# Altium project MotherBoard.PrjPcb
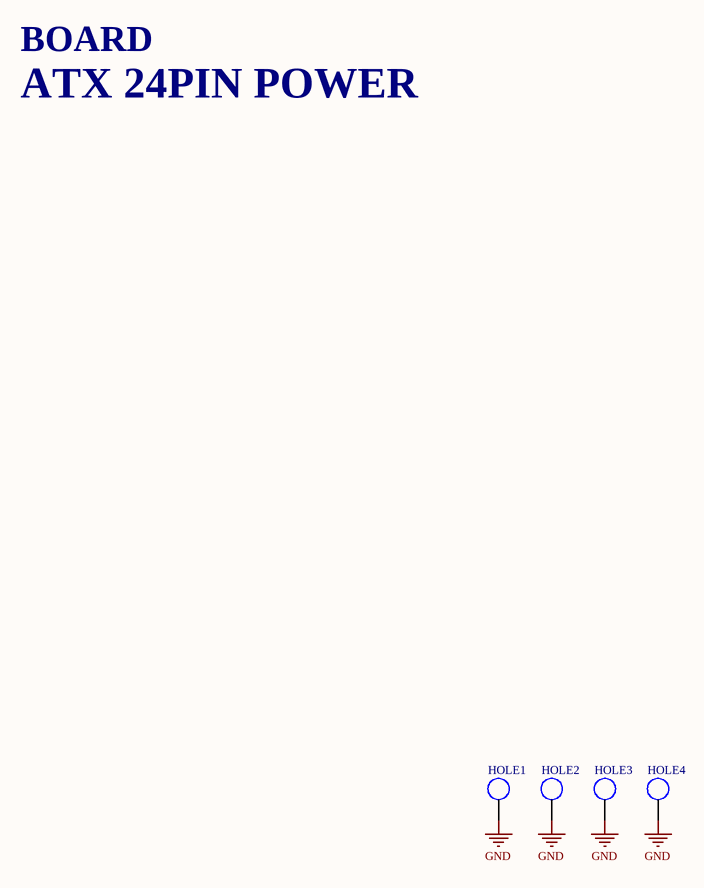
[diagram p0: 00_POWER.SchDoc]
5 sheets, 23 parts. Net scope: flat (ports and power ports of the same name join across sheets).
Board file: Board.PcbDoc
Sheets:
  00_POWER.SchDoc
  01_COREBOARD.SchDoc
  02_HDMI.SchDoc
  03_USB.SchDoc
  04_GBEPHY.SchDoc

## Sheet 00_POWER.SchDoc
size A; SheetNumber: 1; SheetTotal: 5

### Parts
HOLE1  LOADHOLE  [LOADHOLE]  (value not drawn)
HOLE2  LOADHOLE  [LOADHOLE]  (value not drawn)
HOLE3  LOADHOLE  [LOADHOLE]  (value not drawn)
HOLE4  LOADHOLE  [LOADHOLE]  (value not drawn)

### Nets
GND: HOLE1.1 HOLE2.1 HOLE3.1 HOLE4.1

### Notes on the sheet
- BOARD
- ATX 24PIN POWER

## Sheet 01_COREBOARD.SchDoc
size A0; SheetNumber: 2; SheetTotal: 5
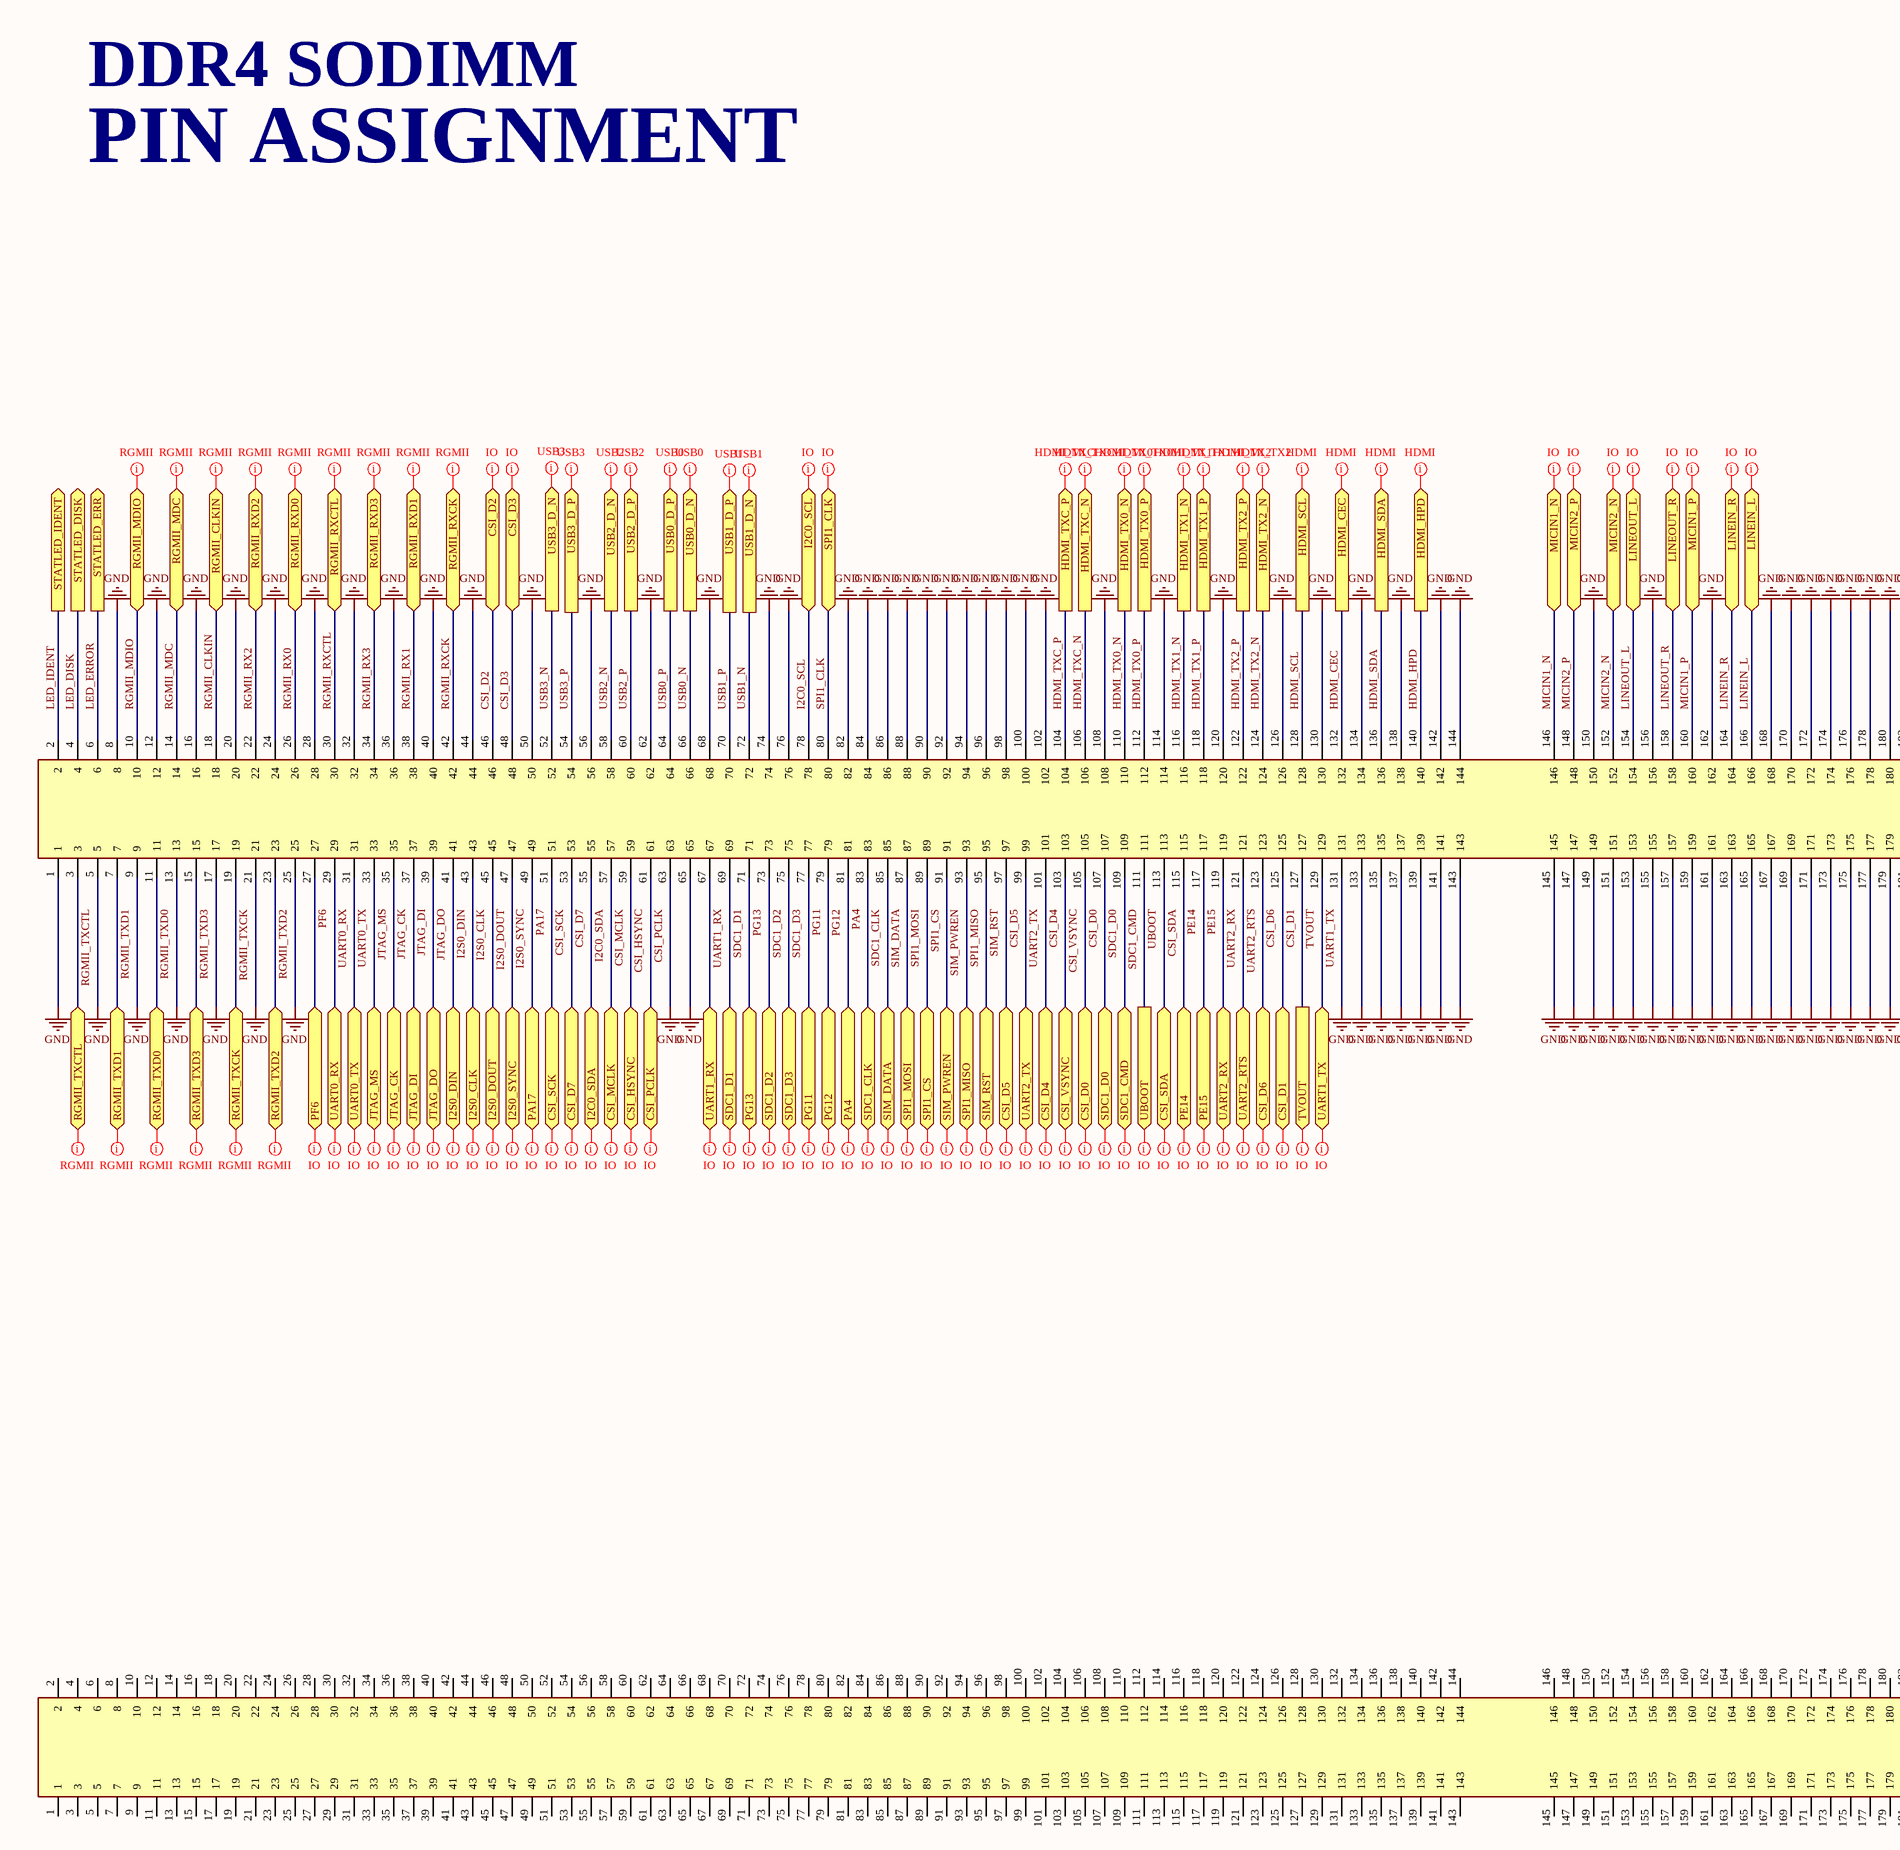
[diagram p1: 01_COREBOARD.SchDoc, left]
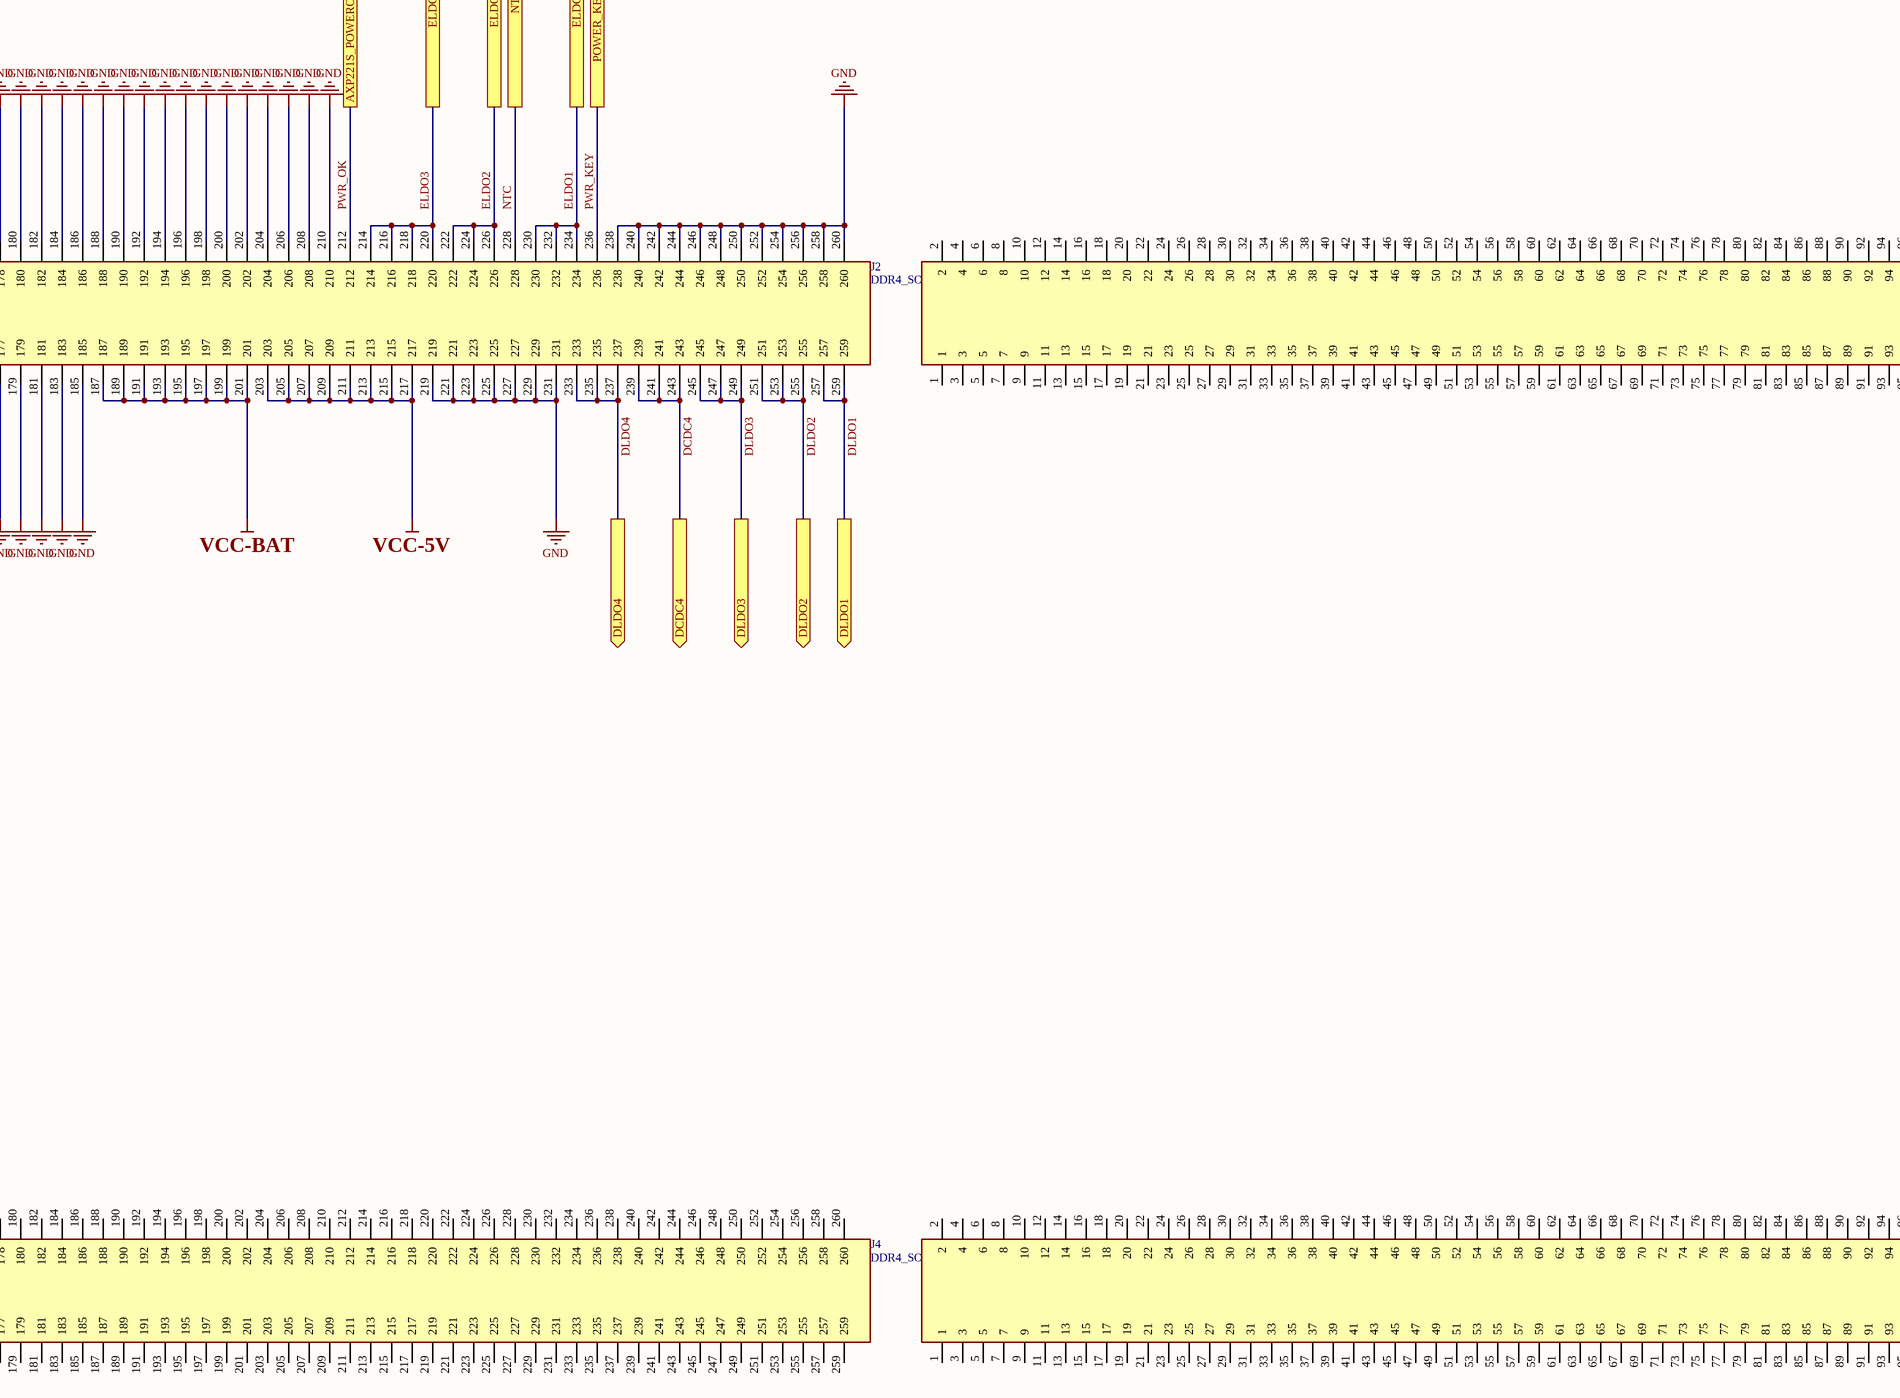
[diagram p2: 01_COREBOARD.SchDoc, middle]
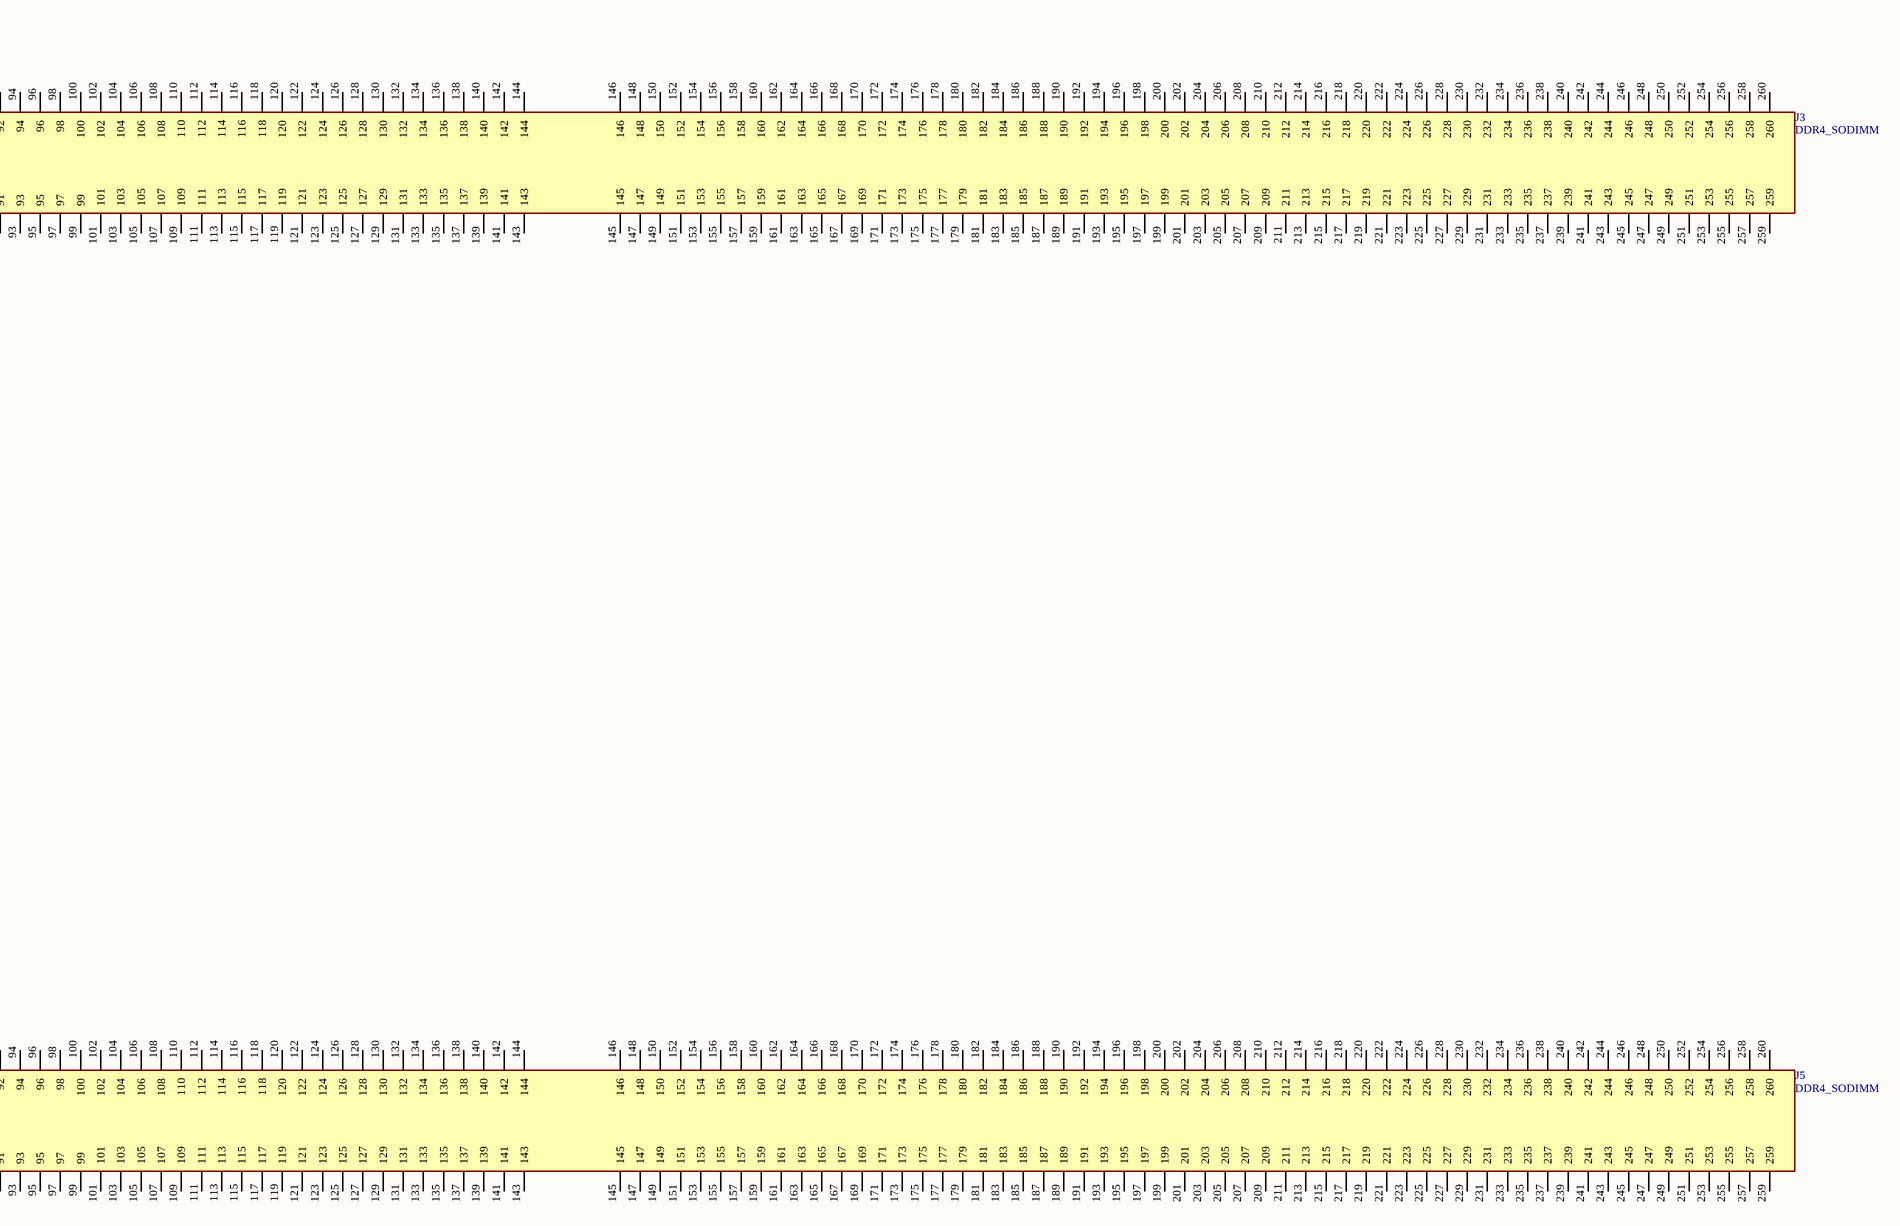
[diagram p3: 01_COREBOARD.SchDoc, right]

### Parts
J2  DDR4_SODIMM  [DDR4_SODIMM]
J3  DDR4_SODIMM  [DDR4_SODIMM]
J4  DDR4_SODIMM  [DDR4_SODIMM]
J5  DDR4_SODIMM  [DDR4_SODIMM]

### Ports
AXP221S_POWEROK (out), CSI_D0 (bidir), CSI_D1 (bidir), CSI_D2 (bidir), CSI_D3 (bidir), CSI_D4 (bidir), CSI_D5 (bidir), CSI_D6 (bidir), CSI_D7 (bidir), CSI_HSYNC (bidir), CSI_MCLK (bidir), CSI_PCLK (bidir), CSI_SCK (bidir), CSI_SDA (bidir), CSI_VSYNC (bidir), DCDC4 (out), DLDO1 (out), DLDO2 (out), DLDO3 (out), DLDO4 (out), ELDO1 (out), ELDO2 (out), ELDO3 (out), HDMI_CEC (out), HDMI_HPD (out), HDMI_SCL (out), HDMI_SDA (out), HDMI_TX0_N (out), HDMI_TX0_P (out), HDMI_TX1_N (out), HDMI_TX1_P (out), HDMI_TX2_N (out), HDMI_TX2_P (out), HDMI_TXC_N (out), HDMI_TXC_P (out), I2C0_SCL (bidir), I2C0_SDA (bidir), I2S0_CLK (bidir), I2S0_DIN (bidir), I2S0_DOUT (bidir), I2S0_SYNC (bidir), JTAG_CK (bidir), JTAG_DI (bidir), JTAG_DO (bidir), JTAG_MS (bidir), LINEIN_L (bidir), LINEIN_R (bidir), LINEOUT_L (bidir), LINEOUT_R (bidir), MICIN1_N (bidir), MICIN1_P (bidir), MICIN2_N (bidir), MICIN2_P (bidir), NTC (out), PA4 (bidir), PA17 (bidir), PE14 (bidir), PE15 (bidir), PF6 (bidir), PG11 (bidir), PG12 (bidir), PG13 (bidir), POWER_KEY (out), RGMII_CLKIN (bidir), RGMII_MDC (bidir), RGMII_MDIO (bidir), RGMII_RXCK (bidir), RGMII_RXCTL (bidir), RGMII_RXD0 (bidir), RGMII_RXD1 (bidir), RGMII_RXD2 (bidir), RGMII_RXD3 (bidir), RGMII_TXCK (bidir), RGMII_TXCTL (bidir), RGMII_TXD0 (bidir), RGMII_TXD1 (bidir), RGMII_TXD2 (bidir), RGMII_TXD3 (bidir), SDC1_CLK (bidir), SDC1_CMD (bidir), SDC1_D0 (bidir), SDC1_D1 (bidir), SDC1_D2 (bidir), SDC1_D3 (bidir), SIM_DATA (bidir), SIM_PWREN (bidir), SIM_RST (bidir), SPI1_CLK (bidir), SPI1_CS (bidir), SPI1_MISO (bidir), SPI1_MOSI (bidir), STATLED_DISK (out), STATLED_ERR (out), STATLED_IDENT (out), TVOUT (out), UART0_RX (bidir), UART0_TX (bidir), UART1_RX (bidir), UART1_TX (bidir), UART2_RTS (bidir), UART2_RX (bidir), UART2_TX (bidir), UBOOT (out), USB0_D_N (out), USB0_D_P (out), USB1_D_N (out), USB1_D_P (out), USB2_D_N (out), USB2_D_P (out), USB3_D_N (out), USB3_D_P (out)

### Nets
GND: J2.1 J2.5 J2.8 J2.9 J2.12 J2.13 J2.16 J2.17 J2.20 J2.21 J2.24 J2.25 J2.28 J2.32 J2.36 J2.40 J2.44 J2.50 J2.56 J2.62 J2.63 J2.65 J2.68 J2.74 J2.76 J2.82 J2.84 J2.86 J2.88 J2.90 J2.92 J2.94 J2.96 J2.98 J2.100 J2.102 J2.108 J2.114 J2.120 J2.126 J2.130 J2.131 J2.133 J2.134 J2.135 J2.137 J2.138 J2.139 J2.141 J2.142 J2.143 J2.144 J2.145 J2.147 J2.149 J2.150 J2.151 J2.153 J2.155 J2.156 J2.157 J2.159 J2.161 J2.162 J2.163 J2.165 J2.167 J2.168 J2.169 J2.170 J2.171 J2.172 J2.173 J2.174 J2.175 J2.176 J2.177 J2.178 J2.179 J2.180 J2.181 J2.182 J2.183 J2.184 J2.185 J2.186 J2.188 J2.190 J2.192 J2.194 J2.196 J2.198 J2.200 J2.202 J2.204 J2.206 J2.208 J2.210 J2.219 J2.221 J2.223 J2.225 J2.227 J2.229 J2.231 J2.238 J2.240 J2.242 J2.244 J2.246 J2.248 J2.250 J2.252 J2.254 J2.256 J2.258 J2.260
VCC-5V: J2.203 J2.205 J2.207 J2.209 J2.211 J2.213 J2.215 J2.217
VCC-BAT: J2.187 J2.189 J2.191 J2.193 J2.195 J2.197 J2.199 J2.201
CSI_D0: J2.105 ; port CSI_D0
CSI_D1: J2.125 ; port CSI_D1
CSI_D2: J2.46 ; port CSI_D2
CSI_D3: J2.48 ; port CSI_D3
CSI_D4: J2.101 ; port CSI_D4
CSI_D5: J2.97 ; port CSI_D5
CSI_D6: J2.123 ; port CSI_D6
CSI_D7: J2.53 ; port CSI_D7
CSI_HSYNC: J2.59 ; port CSI_HSYNC
CSI_MCLK: J2.57 ; port CSI_MCLK
CSI_PCLK: J2.61 ; port CSI_PCLK
CSI_SCK: J2.51 ; port CSI_SCK
CSI_SDA: J2.113 ; port CSI_SDA
CSI_VSYNC: J2.103 ; port CSI_VSYNC
DCDC4: J2.239 J2.241 J2.243 ; port DCDC4
DLDO1: J2.257 J2.259 ; port DLDO1
DLDO2: J2.251 J2.253 J2.255 ; port DLDO2
DLDO3: J2.245 J2.247 J2.249 ; port DLDO3
DLDO4: J2.233 J2.235 J2.237 ; port DLDO4
ELDO1: J2.230 J2.232 J2.234 ; port ELDO1
ELDO2: J2.222 J2.224 J2.226 ; port ELDO2
ELDO3: J2.214 J2.216 J2.218 J2.220 ; port ELDO3
HDMI_CEC: J2.132 ; port HDMI_CEC
HDMI_HPD: J2.140 ; port HDMI_HPD
HDMI_SCL: J2.128 ; port HDMI_SCL
HDMI_SDA: J2.136 ; port HDMI_SDA
HDMI_TX0_N: J2.110 ; port HDMI_TX0_N
HDMI_TX0_P: J2.112 ; port HDMI_TX0_P
HDMI_TX1_N: J2.116 ; port HDMI_TX1_N
HDMI_TX1_P: J2.118 ; port HDMI_TX1_P
HDMI_TX2_N: J2.124 ; port HDMI_TX2_N
HDMI_TX2_P: J2.122 ; port HDMI_TX2_P
HDMI_TXC_N: J2.106 ; port HDMI_TXC_N
HDMI_TXC_P: J2.104 ; port HDMI_TXC_P
I2C0_SCL: J2.78 ; port I2C0_SCL
I2C0_SDA: J2.55 ; port I2C0_SDA
I2S0_CLK: J2.43 ; port I2S0_CLK
I2S0_DIN: J2.41 ; port I2S0_DIN
I2S0_DOUT: J2.45 ; port I2S0_DOUT
I2S0_SYNC: J2.47 ; port I2S0_SYNC
JTAG_CK: J2.35 ; port JTAG_CK
JTAG_DI: J2.37 ; port JTAG_DI
JTAG_DO: J2.39 ; port JTAG_DO
JTAG_MS: J2.33 ; port JTAG_MS
LED_DISK: J2.4 ; port STATLED_DISK
LED_ERROR: J2.6 ; port STATLED_ERR
LED_IDENT: J2.2 ; port STATLED_IDENT
LINEIN_L: J2.166 ; port LINEIN_L
LINEIN_R: J2.164 ; port LINEIN_R
LINEOUT_L: J2.154 ; port LINEOUT_L
LINEOUT_R: J2.158 ; port LINEOUT_R
MICIN1_N: J2.146 ; port MICIN1_N
MICIN1_P: J2.160 ; port MICIN1_P
MICIN2_N: J2.152 ; port MICIN2_N
MICIN2_P: J2.148 ; port MICIN2_P
NTC: J2.228 ; port NTC
PA4: J2.81 ; port PA4
PA17: J2.49 ; port PA17
PE14: J2.115 ; port PE14
PE15: J2.117 ; port PE15
PF6: J2.27 ; port PF6
PG11: J2.77 ; port PG11
PG12: J2.79 ; port PG12
PG13: J2.71 ; port PG13
PWR_KEY: J2.236 ; port POWER_KEY
PWR_OK: J2.212 ; port AXP221S_POWEROK
RGMII_CLKIN: J2.18 ; port RGMII_CLKIN
RGMII_MDC: J2.14 ; port RGMII_MDC
RGMII_MDIO: J2.10 ; port RGMII_MDIO
RGMII_RX0: J2.26 ; port RGMII_RXD0
RGMII_RX1: J2.38 ; port RGMII_RXD1
RGMII_RX2: J2.22 ; port RGMII_RXD2
RGMII_RX3: J2.34 ; port RGMII_RXD3
RGMII_RXCK: J2.42 ; port RGMII_RXCK
RGMII_RXCTL: J2.30 ; port RGMII_RXCTL
RGMII_TXCK: J2.19 ; port RGMII_TXCK
RGMII_TXCTL: J2.3 ; port RGMII_TXCTL
RGMII_TXD0: J2.11 ; port RGMII_TXD0
RGMII_TXD1: J2.7 ; port RGMII_TXD1
RGMII_TXD2: J2.23 ; port RGMII_TXD2
RGMII_TXD3: J2.15 ; port RGMII_TXD3
SDC1_CLK: J2.83 ; port SDC1_CLK
SDC1_CMD: J2.109 ; port SDC1_CMD
SDC1_D0: J2.107 ; port SDC1_D0
SDC1_D1: J2.69 ; port SDC1_D1
SDC1_D2: J2.73 ; port SDC1_D2
SDC1_D3: J2.75 ; port SDC1_D3
SIM_DATA: J2.85 ; port SIM_DATA
SIM_PWREN: J2.91 ; port SIM_PWREN
SIM_RST: J2.95 ; port SIM_RST
SPI1_CLK: J2.80 ; port SPI1_CLK
SPI1_CS: J2.89 ; port SPI1_CS
SPI1_MISO: J2.93 ; port SPI1_MISO
SPI1_MOSI: J2.87 ; port SPI1_MOSI
TVOUT: J2.127 ; port TVOUT
UART0_RX: J2.29 ; port UART0_RX
UART0_TX: J2.31 ; port UART0_TX
UART1_RX: J2.67 ; port UART1_RX
UART1_TX: J2.129 ; port UART1_TX
UART2_RTS: J2.121 ; port UART2_RTS
UART2_RX: J2.119 ; port UART2_RX
UART2_TX: J2.99 ; port UART2_TX
UBOOT: J2.111 ; port UBOOT
USB0_N: J2.66 ; port USB0_D_N
USB0_P: J2.64 ; port USB0_D_P
USB1_N: J2.72 ; port USB1_D_N
USB1_P: J2.70 ; port USB1_D_P
USB2_N: J2.58 ; port USB2_D_N
USB2_P: J2.60 ; port USB2_D_P
USB3_N: J2.52 ; port USB3_D_N
USB3_P: J2.54 ; port USB3_D_P

Not connected (* = marked no-connect by the designer): J3 1 2 3 4 5 6 7 8 9 10 11 12 13 14 15 16 17 18 19 20 21 22 23 24 25 26 27 28 29 30 31 32 33 34 35 36 37 38 39 40 41 42 43 44 45 46 47 48 49 50 51 52 53 54 55 56 57 58 59 60 61 62 63 64 65 66 67 68 69 70 71 72 73 74 75 76 77 78 79 80 81 82 83 84 85 86 87 88 89 90 91 92 93 94 95 96 97 98 99 100 101 102 103 104 105 106 107 108 109 110 111 112 113 114 115 116 117 118 119 120 121 122 123 124 125 126 127 128 129 130 131 132 133 134 135 136 137 138 139 140 141 142 143 144 145 146 147 148 149 150 151 152 153 154 155 156 157 158 159 160 161 162 163 164 165 166 167 168 169 170 171 172 173 174 175 176 177 178 179 180 181 182 183 184 185 186 187 188 189 190 191 192 193 194 195 196 197 198 199 200 201 202 203 204 205 206 207 208 209 210 211 212 213 214 215 216 217 218 219 220 221 222 223 224 225 226 227 228 229 230 231 232 233 234 235 236 237 238 239 240 241 242 243 244 245 246 247 248 249 250 251 252 253 254 255 256 257 258 259 260; J4 1 2 3 4 5 6 7 8 9 10 11 12 13 14 15 16 17 18 19 20 21 22 23 24 25 26 27 28 29 30 31 32 33 34 35 36 37 38 39 40 41 42 43 44 45 46 47 48 49 50 51 52 53 54 55 56 57 58 59 60 61 62 63 64 65 66 67 68 69 70 71 72 73 74 75 76 77 78 79 80 81 82 83 84 85 86 87 88 89 90 91 92 93 94 95 96 97 98 99 100 101 102 103 104 105 106 107 108 109 110 111 112 113 114 115 116 117 118 119 120 121 122 123 124 125 126 127 128 129 130 131 132 133 134 135 136 137 138 139 140 141 142 143 144 145 146 147 148 149 150 151 152 153 154 155 156 157 158 159 160 161 162 163 164 165 166 167 168 169 170 171 172 173 174 175 176 177 178 179 180 181 182 183 184 185 186 187 188 189 190 191 192 193 194 195 196 197 198 199 200 201 202 203 204 205 206 207 208 209 210 211 212 213 214 215 216 217 218 219 220 221 222 223 224 225 226 227 228 229 230 231 232 233 234 235 236 237 238 239 240 241 242 243 244 245 246 247 248 249 250 251 252 253 254 255 256 257 258 259 260; J5 1 2 3 4 5 6 7 8 9 10 11 12 13 14 15 16 17 18 19 20 21 22 23 24 25 26 27 28 29 30 31 32 33 34 35 36 37 38 39 40 41 42 43 44 45 46 47 48 49 50 51 52 53 54 55 56 57 58 59 60 61 62 63 64 65 66 67 68 69 70 71 72 73 74 75 76 77 78 79 80 81 82 83 84 85 86 87 88 89 90 91 92 93 94 95 96 97 98 99 100 101 102 103 104 105 106 107 108 109 110 111 112 113 114 115 116 117 118 119 120 121 122 123 124 125 126 127 128 129 130 131 132 133 134 135 136 137 138 139 140 141 142 143 144 145 146 147 148 149 150 151 152 153 154 155 156 157 158 159 160 161 162 163 164 165 166 167 168 169 170 171 172 173 174 175 176 177 178 179 180 181 182 183 184 185 186 187 188 189 190 191 192 193 194 195 196 197 198 199 200 201 202 203 204 205 206 207 208 209 210 211 212 213 214 215 216 217 218 219 220 221 222 223 224 225 226 227 228 229 230 231 232 233 234 235 236 237 238 239 240 241 242 243 244 245 246 247 248 249 250 251 252 253 254 255 256 257 258 259 260

### Layout directives
differential pair; differential pair class USB0; rule Differential Pairs Routing [Pref Gap = 6mil    Min Gap  = 6mil    Max Gap  = 6milPref Width = 4.29mil    Min Width  = 4.29mil    Max Width  = 4.29mil]; net class USB: USB0_N, USB0_P
differential pair; differential pair class USB2; rule Differential Pairs Routing [Pref Gap = 6mil    Min Gap  = 6mil    Max Gap  = 6milPref Width = 4.29mil    Min Width  = 4.29mil    Max Width  = 4.29mil]; net class USB: USB2_N, USB2_P
differential pair; differential pair class USB3; rule Differential Pairs Routing [Pref Gap = 6mil    Min Gap  = 6mil    Max Gap  = 6milPref Width = 4.29mil    Min Width  = 4.29mil    Max Width  = 4.29mil]; net class USB: USB3_N, USB3_P
differential pair; differential pair class USB1; rule Differential Pairs Routing [Pref Gap = 6mil    Min Gap  = 6mil    Max Gap  = 6milPref Width = 4.29mil    Min Width  = 4.29mil    Max Width  = 4.29mil]; net class USB: USB1_N, USB1_P
net class RGMII; rule Width Constraint [Pref Width = 4.99mil    Min Width = 4.99mil    Max Width = 4.99mil]: RGMII_CLKIN, RGMII_MDC, RGMII_MDIO, RGMII_RX0, RGMII_RX1, RGMII_RX2, RGMII_RX3, RGMII_RXCK, RGMII_RXCTL, RGMII_TXCK, RGMII_TXCTL, RGMII_TXD0, RGMII_TXD1, RGMII_TXD2, RGMII_TXD3
net class GPIO: I2C0_SCL, I2C0_SDA, I2S0_CLK, I2S0_DIN, I2S0_DOUT, I2S0_SYNC, JTAG_CK, JTAG_DI, JTAG_DO, JTAG_MS, LINEIN_L, LINEIN_R, LINEOUT_L, LINEOUT_R, MICIN1_N, MICIN1_P, MICIN2_N, MICIN2_P, PA4, PA17, PE14, PE15, PF6, PG11, PG12, PG13, SDC1_CLK, SDC1_CMD, SDC1_D0, SDC1_D1, SDC1_D2, SDC1_D3, SIM_DATA, SIM_PWREN, SIM_RST, SPI1_CLK, SPI1_CS, SPI1_MISO, SPI1_MOSI, TVOUT, UART0_RX, UART0_TX, UART1_RX, UART1_TX, UART2_RTS, UART2_RX, UART2_TX, UBOOT
differential pair; differential pair class HDMI_TX0; rule Differential Pairs Routing [Pref Gap = 6mil    Min Gap  = 6mil    Max Gap  = 6milPref Width = 4.29mil    Min Width  = 4.29mil    Max Width  = 4.29mil]; net class HDMI: HDMI_TX0_N, HDMI_TX0_P
differential pair; differential pair class HDMI_TX1; rule Differential Pairs Routing [Pref Gap = 6mil    Min Gap  = 6mil    Max Gap  = 6milPref Width = 4.29mil    Min Width  = 4.29mil    Max Width  = 4.29mil]; net class HDMI: HDMI_TX1_N, HDMI_TX1_P
differential pair; differential pair class HDMI_TX2; rule Differential Pairs Routing [Pref Gap = 6mil    Min Gap  = 6mil    Max Gap  = 6milPref Width = 4.29mil    Min Width  = 4.29mil    Max Width  = 4.29mil]; net class HDMI: HDMI_TX2_N, HDMI_TX2_P
differential pair; differential pair class HDMI_TXC; rule Differential Pairs Routing [Pref Gap = 6mil    Min Gap  = 6mil    Max Gap  = 6milPref Width = 4.29mil    Min Width  = 4.29mil    Max Width  = 4.29mil]; net class HDMI: HDMI_TXC_N, HDMI_TXC_P
net class GPIO; net class CSI: CSI_D0, CSI_D1, CSI_D2, CSI_D3, CSI_D4, CSI_D5, CSI_D6, CSI_D7, CSI_HSYNC, CSI_MCLK, CSI_PCLK, CSI_SCK, CSI_SDA, CSI_VSYNC
net class HDMI; rule Width Constraint [Pref Width = 4.99mil    Min Width = 4.99mil    Max Width = 4.99mil]: HDMI_CEC, HDMI_HPD, HDMI_SCL, HDMI_SDA

### Notes on the sheet
- DDR4 SODIMM
- PIN ASSIGNMENT

## Sheet 02_HDMI.SchDoc
size A; SheetNumber: 3; SheetTotal: 5
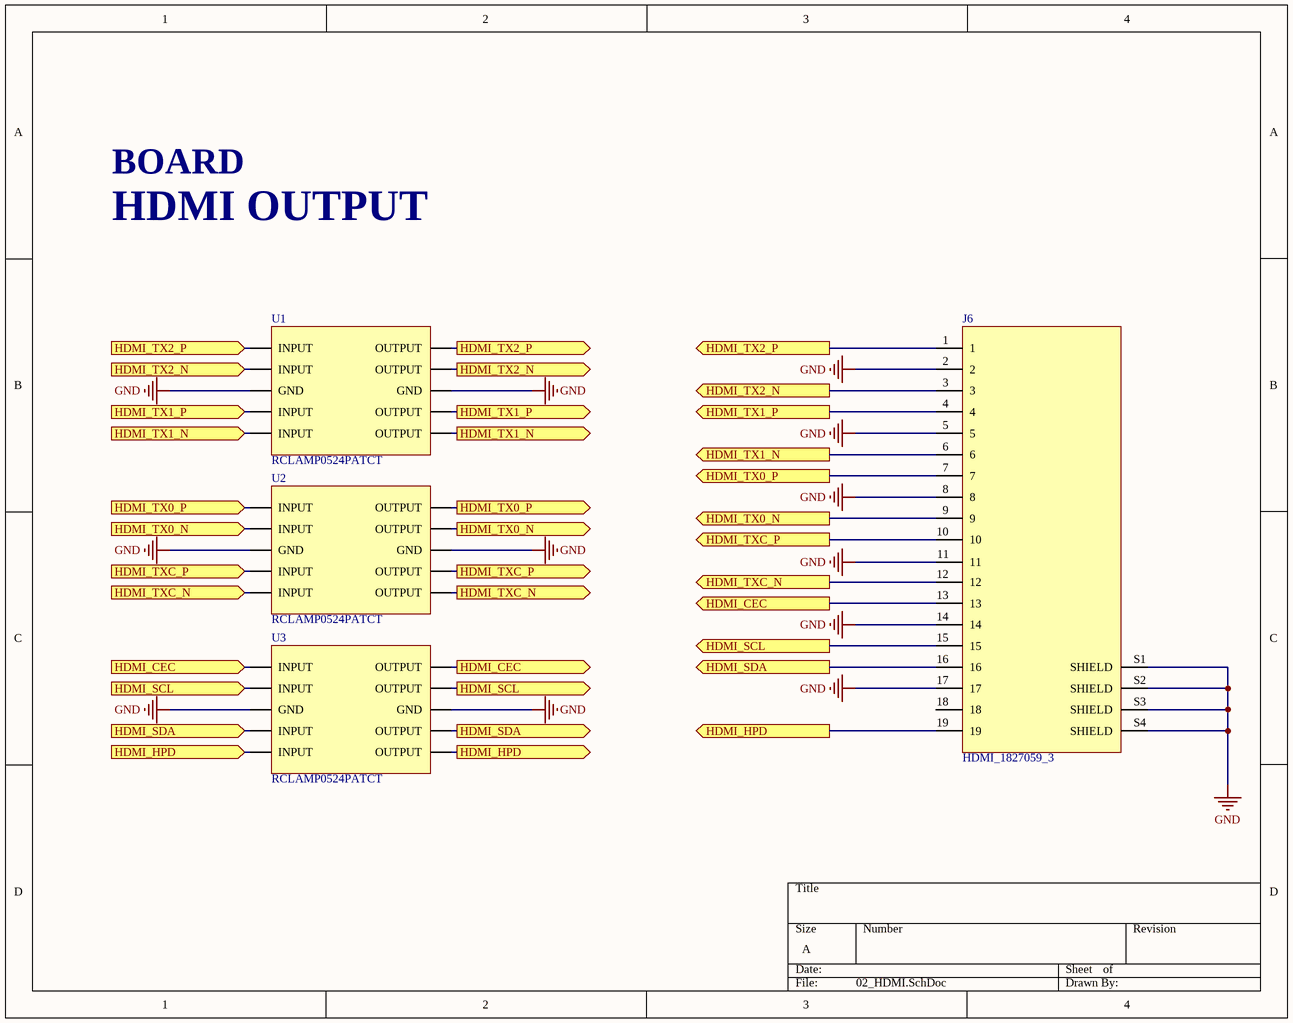
[diagram p4: 02_HDMI.SchDoc]

### Parts
J6  HDMI_1827059_3  [HDMI_1827059_3]
U1  RCLAMP0524PATCT  [RCLAMP0524PATCT]
U2  RCLAMP0524PATCT  [RCLAMP0524PATCT]
U3  RCLAMP0524PATCT  [RCLAMP0524PATCT]

### Ports
HDMI_CEC (in), HDMI_CEC (out), HDMI_HPD (in), HDMI_HPD (out), HDMI_SCL (in), HDMI_SCL (out), HDMI_SDA (in), HDMI_SDA (out), HDMI_TX0_N (in), HDMI_TX0_N (out), HDMI_TX0_P (in), HDMI_TX0_P (out), HDMI_TX1_N (in), HDMI_TX1_N (out), HDMI_TX1_P (in), HDMI_TX1_P (out), HDMI_TX2_N (in), HDMI_TX2_N (out), HDMI_TX2_P (in), HDMI_TX2_P (out), HDMI_TXC_N (in), HDMI_TXC_N (out), HDMI_TXC_P (in), HDMI_TXC_P (out)

### Nets
GND: J6.2 J6.5 J6.8 J6.11 J6.14 J6.17 J6.S1(SHIELD) J6.S2(SHIELD) J6.S3(SHIELD) J6.S4(SHIELD) U1.3(GND) U1.8(GND) U2.3(GND) U2.8(GND) U3.3(GND) U3.8(GND)
HDMI_CEC: J6.13 U3.1(INPUT) U3.10(OUTPUT) ; port HDMI_CEC
HDMI_HPD: J6.19 U3.5(INPUT) U3.6(OUTPUT) ; port HDMI_HPD
HDMI_SCL: J6.15 U3.2(INPUT) U3.9(OUTPUT) ; port HDMI_SCL
HDMI_SDA: J6.16 U3.4(INPUT) U3.7(OUTPUT) ; port HDMI_SDA
HDMI_TX0_N: J6.9 U2.2(INPUT) U2.9(OUTPUT) ; port HDMI_TX0_N
HDMI_TX0_P: J6.7 U2.1(INPUT) U2.10(OUTPUT) ; port HDMI_TX0_P
HDMI_TX1_N: J6.6 U1.5(INPUT) U1.6(OUTPUT) ; port HDMI_TX1_N
HDMI_TX1_P: J6.4 U1.4(INPUT) U1.7(OUTPUT) ; port HDMI_TX1_P
HDMI_TX2_N: J6.3 U1.2(INPUT) U1.9(OUTPUT) ; port HDMI_TX2_N
HDMI_TX2_P: J6.1 U1.1(INPUT) U1.10(OUTPUT) ; port HDMI_TX2_P
HDMI_TXC_N: J6.12 U2.5(INPUT) U2.6(OUTPUT) ; port HDMI_TXC_N
HDMI_TXC_P: J6.10 U2.4(INPUT) U2.7(OUTPUT) ; port HDMI_TXC_P

Not connected (* = marked no-connect by the designer): J6 18

### Notes on the sheet
- BOARD
- HDMI OUTPUT

## Sheet 03_USB.SchDoc
size A3; SheetNumber: 4; SheetTotal: 5
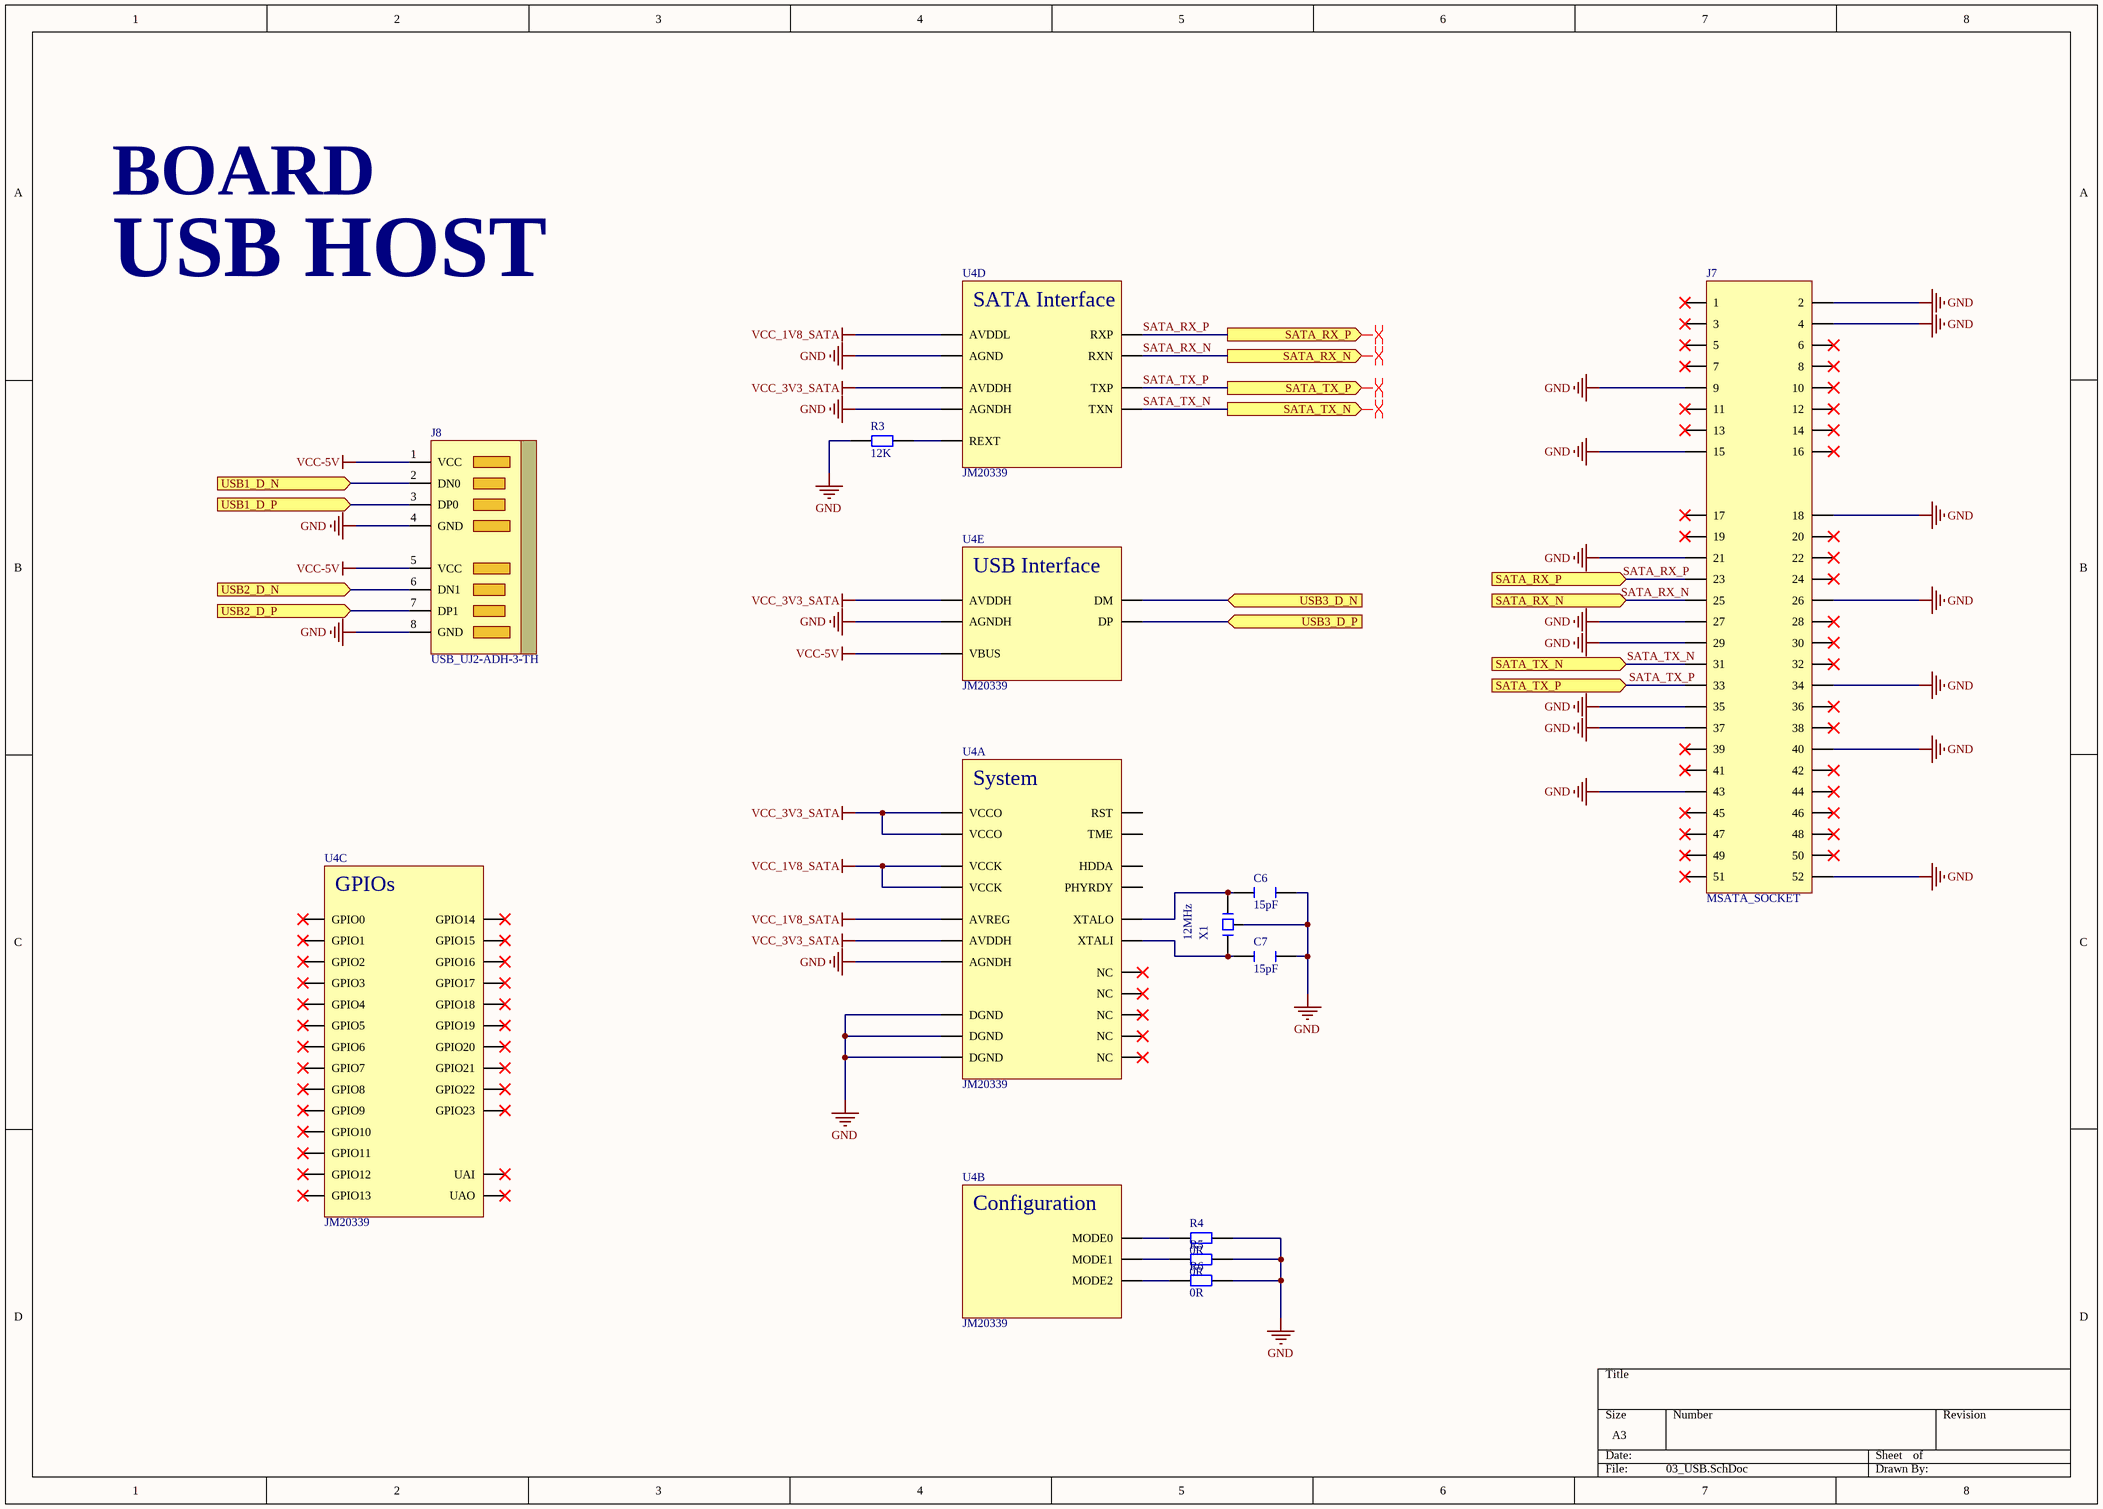
[diagram p5: 03_USB.SchDoc]

### Parts
C6  15pF  [C0402]
C7  15pF  [C0402]
J7  MSATA_SOCKET  [MSATA_SOCKET]
J8  USB_UJ2-ADH-3-TH  [UJ2-ADH-3-TH]
R3  12K  [R0603]
R4  0R  [R0603]
R5  0R  [R0603]
R6  0R  [R0603]
U4  JM20339  [JM20339]  (parts A,B,C,D,E of 5)
X1  12MHz  [SMD3225]

### Ports
SATA_RX_N (in), SATA_RX_N (out), SATA_RX_P (in), SATA_RX_P (out), SATA_TX_N (in), SATA_TX_N (out), SATA_TX_P (in), SATA_TX_P (out), USB1_D_N (in), USB1_D_P (in), USB2_D_N (in), USB2_D_P (in), USB3_D_N (in), USB3_D_P (in)

### Nets
GND: C6.2 C7.2 J7.2 J7.4 J7.9 J7.15 J7.18 J7.21 J7.26 J7.27 J7.29 J7.34 J7.35 J7.37 J7.40 J7.43 J7.52 J8.4(GND) J8.8(GND) R3.1 R4.2 R5.2 R6.2 U4.7(DGND) U4.16(AGNDH) U4.22(AGNDH) U4.25(AGNDH) U4.30(AGND) U4.41(DGND) U4.57(DGND) X1.3(G)
VCC-5V: J8.1(VCC) J8.5(VCC) U4.13(VBUS)
VCC_1V8_SATA: U4.14(AVREG) U4.29(AVDDL) U4.42(VCCK) U4.58(VCCK)
VCC_3V3_SATA: U4.8(VCCO) U4.15(AVDDH) U4.21(AVDDH) U4.24(AVDDH) U4.56(VCCO)
SATA_RX_N: J7.25 U4.28(RXN) ; port SATA_RX_N
SATA_RX_P: J7.23 U4.27(RXP) ; port SATA_RX_P
SATA_TX_N: J7.31 U4.31(TXN) ; port SATA_TX_N
SATA_TX_P: J7.33 U4.32(TXP) ; port SATA_TX_P
USB1_N: J8.2(DN0) ; port USB1_D_N
USB1_P: J8.3(DP0) ; port USB1_D_P
USB2_N: J8.6(DN1) ; port USB2_D_N
USB2_P: J8.7(DP1) ; port USB2_D_P
USB3_N: U4.19(DM) ; port USB3_D_N
USB3_P: U4.20(DP) ; port USB3_D_P
NetC6_1: C6.1 U4.18(XTALO) X1.2(OUT)
NetC7_1: C7.1 U4.17(XTALI) X1.1(IN)
NetR3_2: R3.2 U4.26(REXT)
NetR4_1: R4.1 U4.59(MODE0)
NetR5_1: R5.1 U4.55(MODE1)
NetR6_1: R6.1 U4.4(MODE2)

Not connected (* = marked no-connect by the designer): J7 1* 3* 5* 6* 7* 8* 10* 11* 12* 13* 14* 16* 17* 19* 20* 22* 24* 28* 30* 32* 36* 38* 39* 41* 42* 44* 45* 46* 47* 48* 49* 50* 51*; U4 1(GPIO21)* 2(GPIO22)* 3(GPIO23)* 5(NC)* 6(NC)* 9(NC)* 10(NC)* 11(GPIO7)* 12(RST) 23(NC)* 33(GPIO3)* 34(GPIO2)* 35(GPIO1)* 36(GPIO0)* 37(TME) 38(PHYRDY) 39(HDDA) 40(GPIO4)* 43(GPIO5)* 44(GPIO6)* 45(GPIO9)* 46(GPIO10)* 47(GPIO11)* 48(GPIO12)* 49(GPIO13)* 50(GPIO14)* 51(GPIO15)* 52(GPIO8)* 53(UAI)* 54(UAO)* 60(GPIO16)* 61(GPIO17)* 62(GPIO18)* 63(GPIO19)* 64(GPIO20)*

### Layout directives
differential pair; net class SATA; differential pair class SATA_TXRX; differential pair class SATA_RX: SATA_RX_N, SATA_RX_P
differential pair; net class SATA; differential pair class SATA_TXRX; differential pair class SATA_TX: SATA_TX_N, SATA_TX_P

### Notes on the sheet
- BOARD
- USB HOST
- Labels drawn without touching a wire or pin: SATA_RX_N, SATA_RX_P, SATA_TX_N, SATA_TX_P
- (in symbol JM20339, part A) System
- (in symbol JM20339, part B) Configuration
- (in symbol JM20339, part C) GPIOs
- (in symbol JM20339, part D) SATA Interface
- (in symbol JM20339, part E) USB Interface

### Library data of the parts
C6 C7 = C_15PF
R3 = R_12K
R4-R6 = R_0R
X1 = X_12MHZ

## Sheet 04_GBEPHY.SchDoc
size A4; SheetNumber: 5; SheetTotal: 5
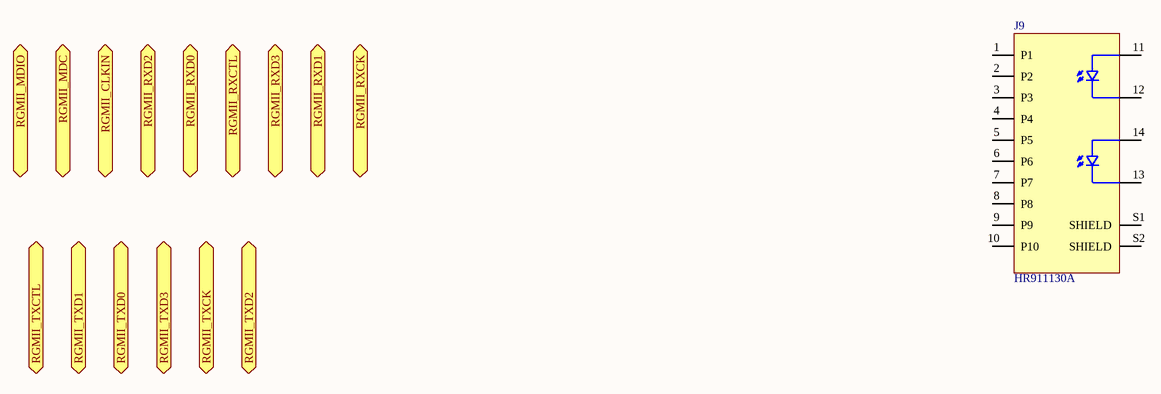
[diagram p6: 04_GBEPHY.SchDoc]

### Parts
J9  HR911130A  [HR911130A]

### Ports
RGMII_CLKIN (bidir), RGMII_MDC (bidir), RGMII_MDIO (bidir), RGMII_RXCK (bidir), RGMII_RXCTL (bidir), RGMII_RXD0 (bidir), RGMII_RXD1 (bidir), RGMII_RXD2 (bidir), RGMII_RXD3 (bidir), RGMII_TXCK (bidir), RGMII_TXCTL (bidir), RGMII_TXD0 (bidir), RGMII_TXD1 (bidir), RGMII_TXD2 (bidir), RGMII_TXD3 (bidir)

### Nets

Not connected (* = marked no-connect by the designer): J9 1(P1) 2(P2) 3(P3) 4(P4) 5(P5) 6(P6) 7(P7) 8(P8) 9(P9) 10(P10) 11 12 13 14 S1(SHIELD) S2(SHIELD)

### Notes on the sheet
- (in symbol HR911130A) GREEN; YELLOW

## Nets that join several sheets
GND: 00_POWER (HOLE1.1 HOLE2.1 HOLE3.1 HOLE4.1), 01_COREBOARD (117 pins), 02_HDMI (16 pins), 03_USB (31 pins)
VCC-5V: 01_COREBOARD (8 pins), 03_USB (J8.1 J8.5 U4.13)
HDMI_CEC: 01_COREBOARD (J2.132), 02_HDMI (J6.13 U3.1 U3.10)
HDMI_HPD: 01_COREBOARD (J2.140), 02_HDMI (J6.19 U3.5 U3.6)
HDMI_SCL: 01_COREBOARD (J2.128), 02_HDMI (J6.15 U3.2 U3.9)
HDMI_SDA: 01_COREBOARD (J2.136), 02_HDMI (J6.16 U3.4 U3.7)
HDMI_TX0_N: 01_COREBOARD (J2.110), 02_HDMI (J6.9 U2.2 U2.9)
HDMI_TX0_P: 01_COREBOARD (J2.112), 02_HDMI (J6.7 U2.1 U2.10)
HDMI_TX1_N: 01_COREBOARD (J2.116), 02_HDMI (J6.6 U1.5 U1.6)
HDMI_TX1_P: 01_COREBOARD (J2.118), 02_HDMI (J6.4 U1.4 U1.7)
HDMI_TX2_N: 01_COREBOARD (J2.124), 02_HDMI (J6.3 U1.2 U1.9)
HDMI_TX2_P: 01_COREBOARD (J2.122), 02_HDMI (J6.1 U1.1 U1.10)
HDMI_TXC_N: 01_COREBOARD (J2.106), 02_HDMI (J6.12 U2.5 U2.6)
HDMI_TXC_P: 01_COREBOARD (J2.104), 02_HDMI (J6.10 U2.4 U2.7)
USB1_N: 01_COREBOARD (J2.72), 03_USB (J8.2)
USB1_P: 01_COREBOARD (J2.70), 03_USB (J8.3)
USB2_N: 01_COREBOARD (J2.58), 03_USB (J8.6)
USB2_P: 01_COREBOARD (J2.60), 03_USB (J8.7)
USB3_N: 01_COREBOARD (J2.52), 03_USB (U4.19)
USB3_P: 01_COREBOARD (J2.54), 03_USB (U4.20)